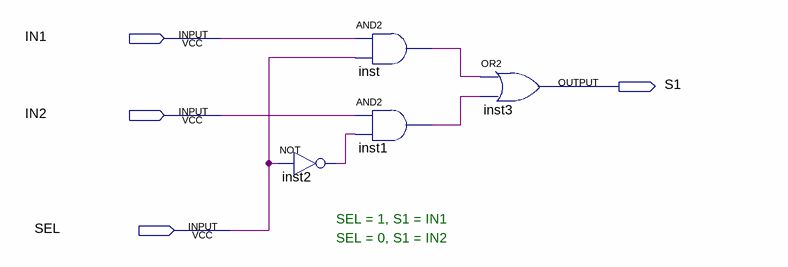
[diagram p0: schematic sheet]
// Quartus schematic Mux2para1.bdf as structural Verilog: 4 symbols, 4 pins
module Mux2para1 (
  input  IN1,
  input  IN2,
  input  SEL,
  output S1
);

  wire inst1_out, inst2_out, inst_out;

  not inst2 (inst2_out, SEL);
  and inst (inst_out, IN1, SEL);
  and inst1 (inst1_out, IN2, inst2_out);
  or inst3 (S1, inst_out, inst1_out);

  // Notes on the sheet:
  //   SEL = 1, S1 = IN1
  //   SEL = 0, S1 = IN2
endmodule
